# Altium project SCB.PrjPCB (part 1 of 2)
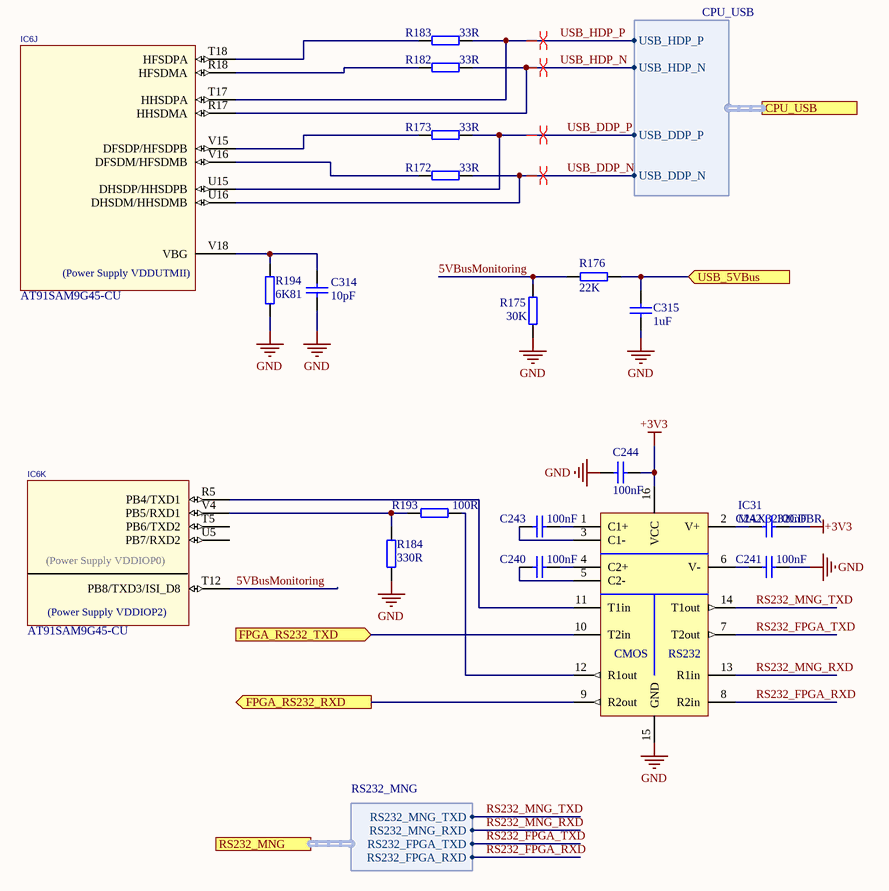
[diagram p0: RS232_and_USB_ports.SchDoc]
Date: 12/06/2012; Project: White Rabbit; Revision: 3.2
9 sheets, 226 parts. Net scope: hierarchical (ports join the sheet entries above them; power ports are global).
Board file: uTCA_MCH_PCB3.pcbdoc
Sheets:
  RS232_and_USB_ports.SchDoc
  CPU_EBI1_FPGA_Memory.SchDoc
  CPU_100M_Ethernet.SchDoc
  FPGA_GTX.SchDoc
  FPGA_Configuration.SchDoc
  uTCA_Tongue3.SchDoc
  SMI_Link_7-12.SchDoc
  QDRII_mem.SchDoc
    U_QDRII_power = QDRII_power.SchDoc

## Sheet RS232_and_USB_ports.SchDoc: RS232_and_USB_ports
size A4 portrait; Revision: 3.4; SheetNumber: 4; SheetTotal: 23; Date: 18/06/2014; DrawnBy: J. Gabriel R.E.; Organization: Seven Solutions S.L.; Address1: C/Baza, Parcela 19, Nave 3; Address2: Polнgono Ind. Juncaril; Address3: 18210-Peligros-Granada; Address4: Spain; WebAddress: www.sevensols.com; Project: White Rabbit; ProjectName: White Rabbit

### Parts
C240  100nF  [CC1005-0402]
C241  100nF  [CC1005-0402]
C242  100nF  [CC1005-0402]
C243  100nF  [CC1005-0402]
C244  100nF  [CC1005-0402]
C314  10pF  [CC1005-0402]
C315  1uF  [CC1005-0402]
IC6  AT91SAM9G45-CU  [TFBGA324]  (parts J,K of 12)
IC31  MAX3232CDBR  [SOP65P780X200-16N]
R172  33R  [0603]
R173  33R  [0603]
R175  30K  [0402]
R176  22K  [0402]
R182  33R  [0603]
R183  33R  [0603]
R184  330R  [0402]
R193  100R  [0402]
R194  6K81  [0402]

### Ports
CPU_USB (harness CPU_USB), FPGA_RS232_RXD (out), FPGA_RS232_TXD (in), RS232_MNG (harness RS232_MNG), USB_5VBus (in)

### Harnesses
RS232_MNG: RS232_MNG_TXD, RS232_FPGA_TXD, RS232_MNG_RXD, RS232_FPGA_RXD
CPU_USB: USB_HDP_P, USB_HDP_N, USB_DDP_P, USB_DDP_N

### Nets
+3V3: C242.1 C244.1 IC31.16(VCC)
GND: C241.1 C244.2 C314.1 C315.2 IC31.15(GND) R175.1 R184.2 R194.1
5VBusMonitoring: IC6.T12(PB8/TXD3/ISI_D8) R175.2 R176.2
RS232_FPGA_RXD: IC31.8(R2in) ; port RS232_MNG.RS232_FPGA_RXD
RS232_FPGA_TXD: IC31.7(T2out) ; port RS232_MNG.RS232_FPGA_TXD
RS232_MNG_RXD: IC31.13(R1in) ; port RS232_MNG.RS232_MNG_RXD
RS232_MNG_TXD: IC31.14(T1out) ; port RS232_MNG.RS232_MNG_TXD
USB_DDP_N: IC6.U16(DHSDM/HHSDMB) R172.2 ; port CPU_USB.USB_DDP_N
USB_DDP_P: IC6.U15(DHSDP/HHSDPB) R173.2 ; port CPU_USB.USB_DDP_P
USB_HDP_N: IC6.R17(HHSDMA) R182.2 ; port CPU_USB.USB_HDP_N
USB_HDP_P: IC6.T17(HHSDPA) R183.2 ; port CPU_USB.USB_HDP_P
NetC240_1: C240.1 IC31.4(C2+)
NetC240_2: C240.2 IC31.5(C2-)
NetC241_2: C241.2 IC31.6(V-)
NetC242_2: C242.2 IC31.2(V+)
NetC243_1: C243.1 IC31.1(C1+)
NetC243_2: C243.2 IC31.3(C1-)
NetC314_2: C314.2 IC6.V18(VBG) R194.2
NetC315_1: C315.1 R176.1 ; port USB_5VBus
NetIC6_R5: IC6.R5(PB4/TXD1) IC31.11(T1in)
NetIC6_R18: IC6.R18(HFSDMA) R182.1
NetIC6_T18: IC6.T18(HFSDPA) R183.1
NetIC6_V4: IC6.V4(PB5/RXD1) R184.1 R193.2
NetIC6_V15: IC6.V15(DFSDP/HFSDPB) R173.1
NetIC6_V16: IC6.V16(DFSDM/HFSDMB) R172.1
NetIC31_9: IC31.9(R2out) ; port FPGA_RS232_RXD
NetIC31_10: IC31.10(T2in) ; port FPGA_RS232_TXD
NetIC31_12: IC31.12(R1out) R193.1

Not connected (* = marked no-connect by the designer): IC6 T5(PB6/TXD2) U5(PB7/RXD2)

### Layout directives
differential pair: USB_DDP_N, USB_DDP_P, USB_HDP_N, USB_HDP_P

### Notes on the sheet
- Title:
- Size:
- Revision:
- A4
- Drawn by:
- Date:
- Sheet
- of
- Project:
- (in symbol AT91SAM9G45-CU, part J) (Power Supply VDDUTMII)
- (in symbol AT91SAM9G45-CU, part K) (Power Supply VDDIOP0); (Power Supply VDDIOP2)
- (in symbol IFC_MAX3232) CMOS; RS232

### Library data of the parts
C240-C244 = CC0402_100NF_16V_10%_X7R: Capacitor; Manufacturer1: TDK; Manufacturer1 PN: C1005X7R1C104K; TC: X7R; Tolerance: ±10%; Voltage: 16V; Published: 8-Jun-2000; LatestRevisionDate: 17-Jul-2002; LatestRevisionNote: Re-released for DXP Platform.; PackageReference: RAD-0.3; Publisher: Altium Limited; Distributor1: Digikey; Distributor1 PN: 445-4952-1-ND; Case: 0402; Value: 100nF
C314 = CC0402_10PF_50V_5%_NP0: Capacitor; Manufacturer1: TDK; Manufacturer1 PN: C1005C0G1H100D; TC: NPO; Tolerance: ±10%; Voltage: 50V; Published: 8-Jun-2000; LatestRevisionDate: 17-Jul-2002; LatestRevisionNote: Re-released for DXP Platform.; PackageReference: RAD-0.3; Publisher: Altium Limited; Distributor1: Digikey; Distributor1 PN: 445-1235-1-ND; Case: 0402; Value: 10pF
C315 = CC0402_1UF_16V_10%_X5R: Capacitor; Manufacturer1: TDK; Manufacturer1 PN: C1005X5R1C105K; TC: X5R; Tolerance: ±10%; Voltage: 16V; Published: 8-Jun-2000; LatestRevisionDate: 17-Jul-2002; LatestRevisionNote: Re-released for DXP Platform.; PackageReference: RAD-0.3; Publisher: Altium Limited; Distributor1: Digikey; Distributor1 PN: 445-4978-1-ND; Case: 0402; Value: 1uF
IC6 = AT91SAM9G45-CU: Atmel 400MHz ARM926 MCU; Value: AT91SAM9G45-CU; Distributor1 PN: AT91SAM9G45-CU-ND; Distributor1: Digikey
IC31 = IFC_MAX3232: Manufacturer1: Texas Instruments; Distributor1: Digikey; Distributor1 PN: 296-13093-1-ND; Manufacturer1 PN: MAX3232CDBR
R172 R173 R182 R183 = R0603_33R_±1%_0.25W_100PPM: SMD Resistor; Manufacturer1: Vishay/Dale; Manufacturer1 PN: CRCW060333R0FKEAHP; TCR: 100ppm; Power Rating: 0.25W; Tolerance: ±1%; Case: 0402; Distributor1: DigiKey; Distributor1 PN: 541-33.0SCT-ND; Value: 33R
R175 = R0402_30K_±1%_0.1W_100PPM: SMD Resistor; Manufacturer1: Panasonic; Manufacturer1 PN: ERJ-2RKF3002X; TCR: 100ppm; Power Rating: 0.1W; Tolerance: ±1%; Case: 0402; Distributor1: DigiKey; Distributor1 PN: P30.0KLCT-ND; Value: 30K
R176 = R0402_22K_±1%_0.1W_100PPM: SMD Resistor; Manufacturer1: Panasonic; Manufacturer1 PN: ERJ-2RKF2202X; TCR: 100ppm; Power Rating: 0.1W; Tolerance: ±1%; Case: 0402; Distributor1: DigiKey; Distributor1 PN: P22.0KLCT-ND; Value: 22K
R184 = R0402_330R_±1%_0.1W_100PPM: SMD Resistor; Manufacturer1: Panasonic; Manufacturer1 PN: ERJ-2RKF3300X; TCR: 100ppm; Power Rating: 0.1W; Tolerance: ±1%; Case: 0402; Distributor1: DigiKey; Distributor1 PN: P330LCT-ND; Value: 330R
R193 = R0402_100R_±1%_0.1W_100PPM: SMD Resistor; Manufacturer1: Panasonic; Manufacturer1 PN: ERJ-2RKF1000X; TCR: 100ppm; Power Rating: 0.1W; Tolerance: ±1%; Case: 0402; Distributor1: DigiKey; Distributor1 PN: P100LCT-ND; Value: 100R
R194 = R0402_6K81_±1%_0.1W_100PPM: SMD Resistor; Manufacturer1: Panasonic; Manufacturer1 PN: ERJ-2RKF6811X; TCR: 100ppm; Power Rating: 0.1W; Tolerance: ±1%; Case: 0402; Distributor1: DigiKey; Distributor1 PN: P6.81KLCT-ND; Value: 6K81

## Sheet CPU_EBI1_FPGA_Memory.SchDoc: CPU_EBI1_FPGA_Memory
size A3; Date: 18/06/2014; DrawnBy: J. Gabriel R.E.; Organization: Seven Solutions S.L.; Address1: C/Baza, Parcela 19, Nave 3; Address2: Polнgono Ind. Juncaril; Address3: 18210-Peligros-Granada; Address4: Spain; Revision: 3.4; SheetNumber: 5; SheetTotal: 23; WebAddress: www.sevensols.com; Project: White Rabbit; ProjectName: Project Name
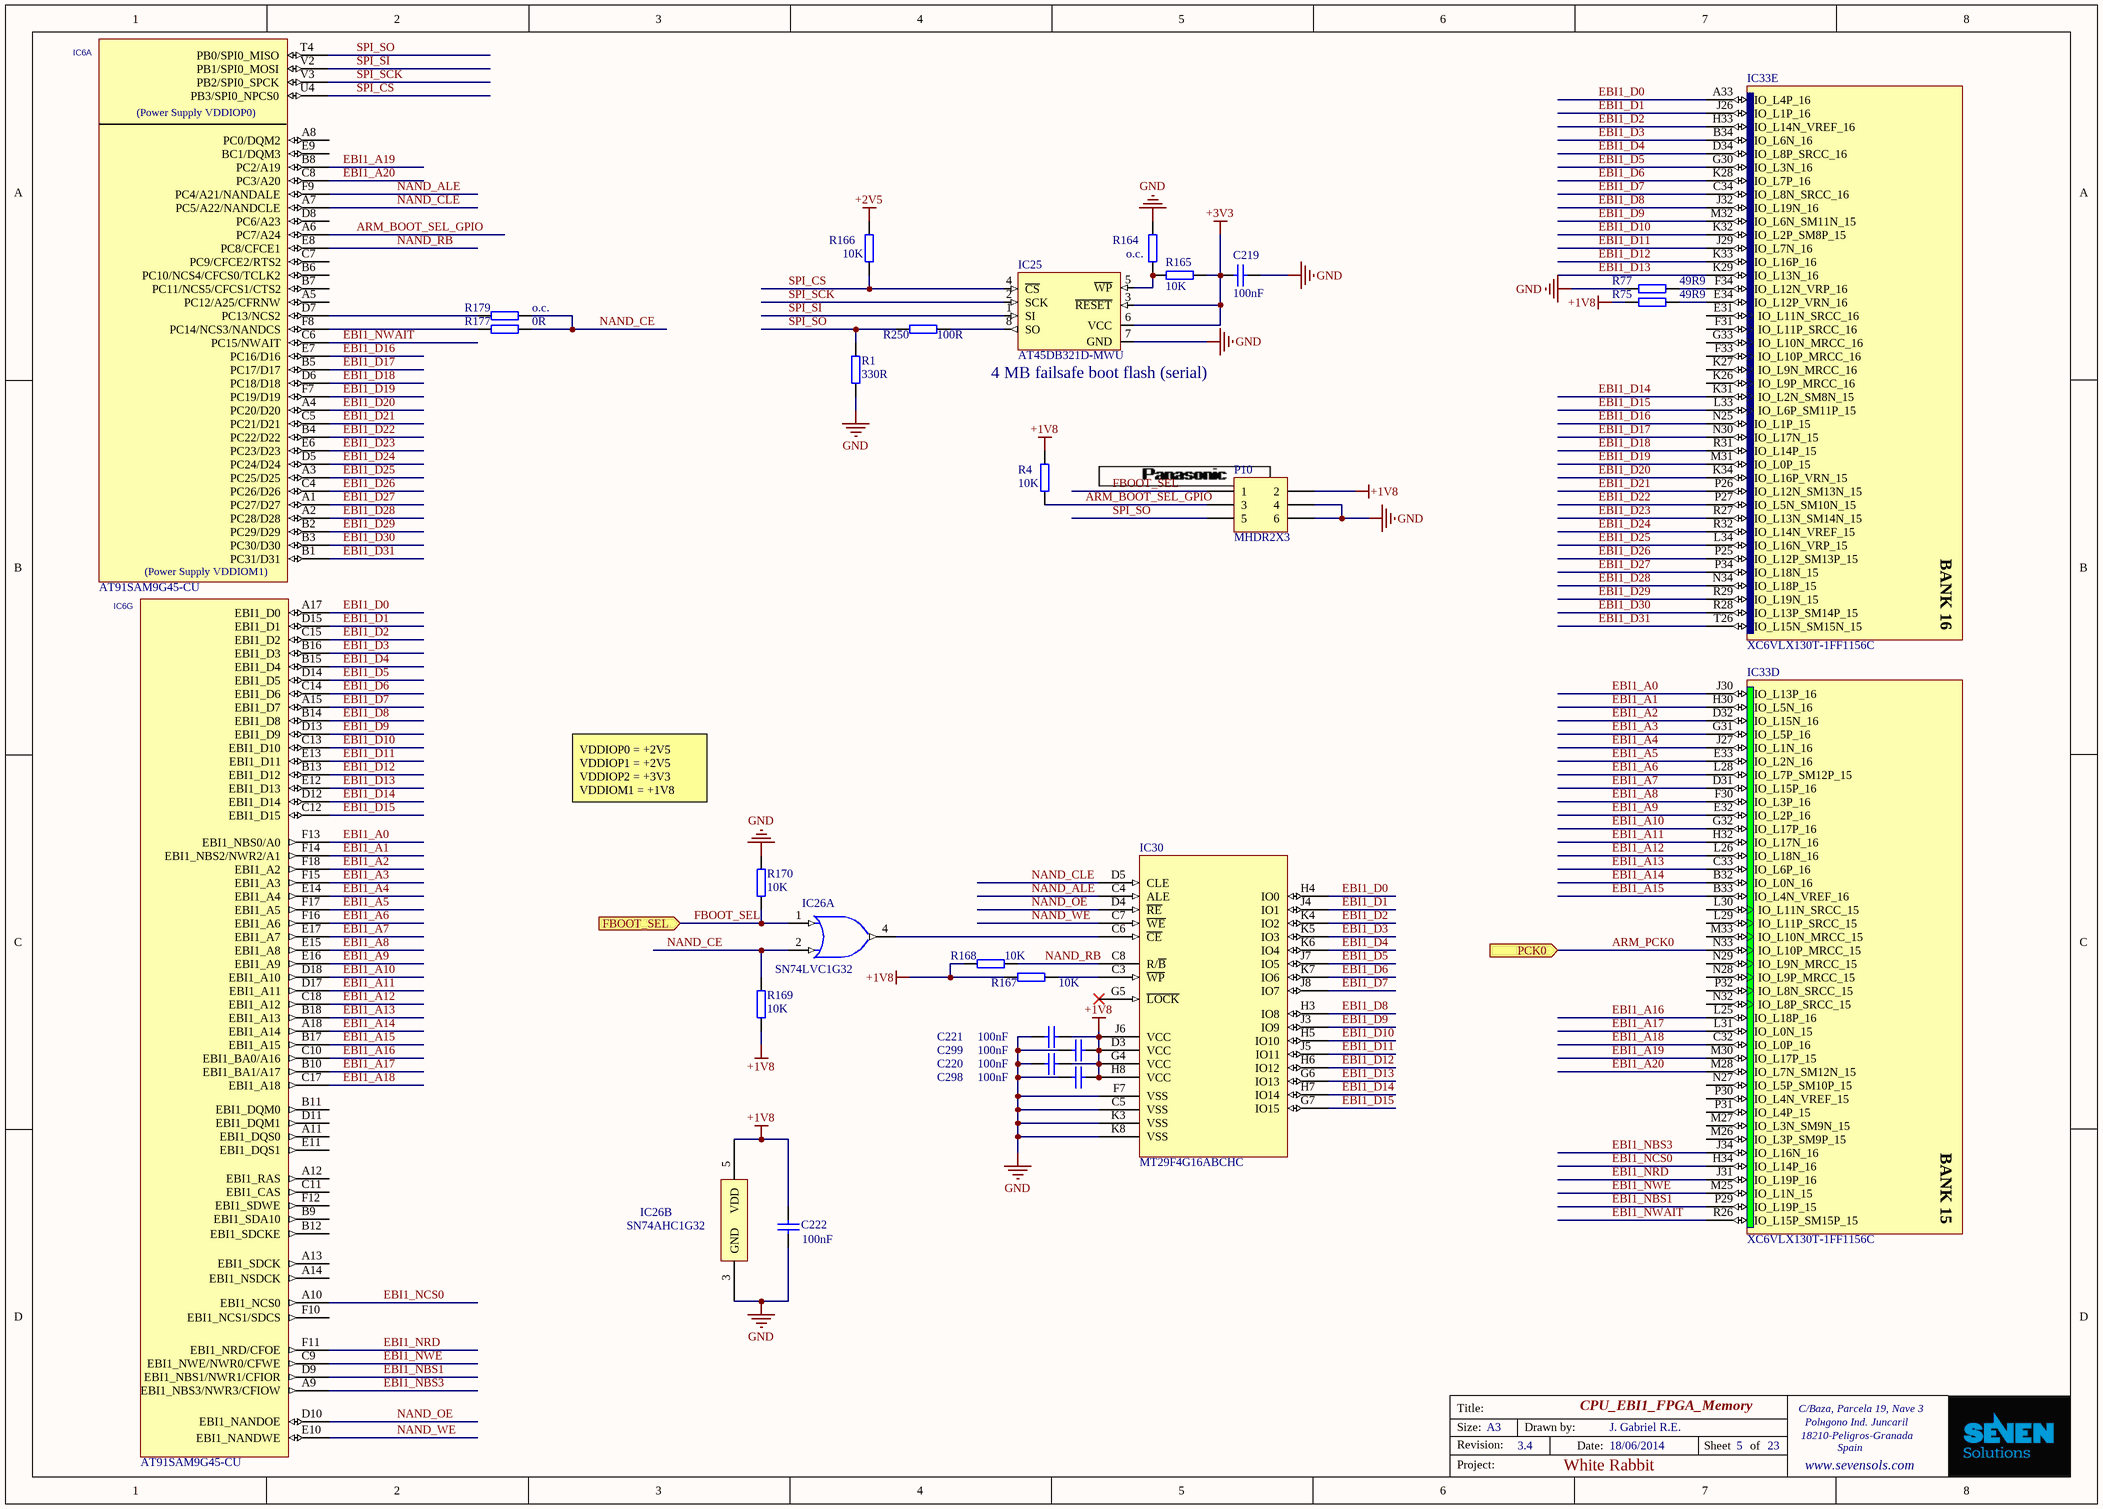
[diagram p1: CPU_EBI1_FPGA_Memory.SchDoc]

### Parts
C219  100nF  [CC1005-0402]
C220  100nF  [CC1005-0402]
C221  100nF  [CC1005-0402]
C222  100nF  [CC1005-0402]
C298  100nF  [CC1005-0402]
C299  100nF  [CC1005-0402]
IC6  AT91SAM9G45-CU  [TFBGA324]  (parts A,G of 12)
IC25  AT45DB321D-MWU  [8MW_8CN3_Merge]
IC26  SN74LVC1G32  [SOT23-5AL]  (parts A,B of 2)
IC30  MT29F4G16ABCHC  [VFBGA63]
IC33  XC6VLX130T-1FF1156C  [FF1156]  (parts D,E of 20)
P10  MHDR2X3  [MHDR2X3_1.27mm]
R1  330R  [0402]
R4  10K  [0402]
R75  49R9  [0402]
R77  49R9  [0402]
R164  o.c.  [0402]
R165  10K  [0402]
R166  10K  [0402]
R167  10K  [0402]
R168  10K  [0402]
R169  10K  [0402]
R170  10K  [0402]
R177  0R  [0603]
R179  o.c.  [0402]
R250  100R  [0402]

### Ports
FBOOT_SEL (in), PCK0 (in)

### Nets
+1V8: C220.1 C221.1 C222.2 C298.1 C299.1 IC26.5(VDD) IC30.D3(VCC) IC30.G4(VCC) IC30.H8(VCC) IC30.J6(VCC) P10.2 R4.2 R75.2 R167.2 R168.2 R169.2
+2V5: R166.2
+3V3: C219.1 IC25.3(~{RESET}) IC25.6(VCC) R165.2
GND: C219.2 C220.2 C221.2 C222.1 C298.2 C299.2 IC25.7(GND) IC26.3(GND) IC30.C5(VSS) IC30.F7(VSS) IC30.K3(VSS) IC30.K8(VSS) P10.4 P10.6 R1.1 R77.2 R164.1 R170.2
ARM_BOOT_SEL_GPIO: IC6.A6(PC7/A24) P10.3 R4.1
ARM_PCK0: IC33.N33(IO_L10P_MRCC_15) ; port PCK0
EBI1_A0: IC6.F13(EBI1_NBS0/A0) IC33.J30(IO_L13P_16)
EBI1_A1: IC6.F14(EBI1_NBS2/NWR2/A1) IC33.H30(IO_L5N_16)
EBI1_A2: IC6.F18(EBI1_A2) IC33.D32(IO_L15N_16)
EBI1_A3: IC6.F15(EBI1_A3) IC33.G31(IO_L5P_16)
EBI1_A4: IC6.E14(EBI1_A4) IC33.J27(IO_L1N_16)
EBI1_A5: IC6.F17(EBI1_A5) IC33.E33(IO_L2N_16)
EBI1_A6: IC6.F16(EBI1_A6) IC33.L28(IO_L7P_SM12P_15)
EBI1_A7: IC6.E17(EBI1_A7) IC33.D31(IO_L15P_16)
EBI1_A8: IC6.E15(EBI1_A8) IC33.F30(IO_L3P_16)
EBI1_A9: IC6.E16(EBI1_A9) IC33.E32(IO_L2P_16)
EBI1_A10: IC6.D18(EBI1_A10) IC33.G32(IO_L17P_16)
EBI1_A11: IC6.D17(EBI1_A11) IC33.H32(IO_L17N_16)
EBI1_A12: IC6.C18(EBI1_A12) IC33.L26(IO_L18N_16)
EBI1_A13: IC6.B18(EBI1_A13) IC33.C33(IO_L6P_16)
EBI1_A14: IC6.A18(EBI1_A14) IC33.B32(IO_L0N_16)
EBI1_A15: IC6.B17(EBI1_A15) IC33.B33(IO_L4N_VREF_16)
EBI1_A16: IC6.C10(EBI1_BA0/A16) IC33.L25(IO_L18P_16)
EBI1_A17: IC6.B10(EBI1_BA1/A17) IC33.L31(IO_L0N_15)
EBI1_A18: IC6.C17(EBI1_A18) IC33.C32(IO_L0P_16)
EBI1_A19: IC6.B8(PC2/A19) IC33.M30(IO_L17P_15)
EBI1_A20: IC6.C8(PC3/A20) IC33.M28(IO_L7N_SM12N_15)
EBI1_D0: IC6.A17(EBI1_D0) IC30.H4(IO0) IC33.A33(IO_L4P_16)
EBI1_D1: IC6.D15(EBI1_D1) IC30.J4(IO1) IC33.J26(IO_L1P_16)
EBI1_D2: IC6.C15(EBI1_D2) IC30.K4(IO2) IC33.H33(IO_L14N_VREF_16)
EBI1_D3: IC6.B16(EBI1_D3) IC30.K5(IO3) IC33.B34(IO_L6N_16)
EBI1_D4: IC6.B15(EBI1_D4) IC30.K6(IO4) IC33.D34(IO_L8P_SRCC_16)
EBI1_D5: IC6.D14(EBI1_D5) IC30.J7(IO5) IC33.G30(IO_L3N_16)
EBI1_D6: IC6.C14(EBI1_D6) IC30.K7(IO6) IC33.K28(IO_L7P_16)
EBI1_D7: IC6.A15(EBI1_D7) IC30.J8(IO7) IC33.C34(IO_L8N_SRCC_16)
EBI1_D8: IC6.B14(EBI1_D8) IC30.H3(IO8) IC33.J32(IO_L19N_16)
EBI1_D9: IC6.D13(EBI1_D9) IC30.J3(IO9) IC33.M32(IO_L6N_SM11N_15)
EBI1_D10: IC6.C13(EBI1_D10) IC30.H5(IO10) IC33.K32(IO_L2P_SM8P_15)
EBI1_D11: IC6.E13(EBI1_D11) IC30.J5(IO11) IC33.J29(IO_L7N_16)
EBI1_D12: IC6.B13(EBI1_D12) IC30.H6(IO12) IC33.K33(IO_L16P_16)
EBI1_D13: IC6.E12(EBI1_D13) IC30.G6(IO13) IC33.K29(IO_L13N_16)
EBI1_D14: IC6.D12(EBI1_D14) IC30.H7(IO14) IC33.K31(IO_L2N_SM8N_15)
EBI1_D15: IC6.C12(EBI1_D15) IC30.G7(IO15) IC33.L33(IO_L6P_SM11P_15)
EBI1_D16: IC6.E7(PC16/D16) IC33.N25(IO_L1P_15)
EBI1_D17: IC6.B5(PC17/D17) IC33.N30(IO_L17N_15)
EBI1_D18: IC6.D6(PC18/D18) IC33.R31(IO_L14P_15)
EBI1_D19: IC6.F7(PC19/D19) IC33.M31(IO_L0P_15)
EBI1_D20: IC6.A4(PC20/D20) IC33.K34(IO_L16P_VRN_15)
EBI1_D21: IC6.C5(PC21/D21) IC33.P26(IO_L12N_SM13N_15)
EBI1_D22: IC6.B4(PC22/D22) IC33.P27(IO_L5N_SM10N_15)
EBI1_D23: IC6.E6(PC23/D23) IC33.R27(IO_L13N_SM14N_15)
EBI1_D24: IC6.D5(PC24/D24) IC33.R32(IO_L14N_VREF_15)
EBI1_D25: IC6.A3(PC25/D25) IC33.L34(IO_L16N_VRP_15)
EBI1_D26: IC6.C4(PC26/D26) IC33.P25(IO_L12P_SM13P_15)
EBI1_D27: IC6.A1(PC27/D27) IC33.P34(IO_L18N_15)
EBI1_D28: IC6.A2(PC28/D28) IC33.N34(IO_L18P_15)
EBI1_D29: IC6.B2(PC29/D29) IC33.R29(IO_L19N_15)
EBI1_D30: IC6.B3(PC30/D30) IC33.R28(IO_L13P_SM14P_15)
EBI1_D31: IC6.B1(PC31/D31) IC33.T26(IO_L15N_SM15N_15)
EBI1_NBS1: IC6.D9(EBI1_NBS1/NWR1/CFIOR) IC33.P29(IO_L19P_15)
EBI1_NBS3: IC6.A9(EBI1_NBS3/NWR3/CFIOW) IC33.J34(IO_L16N_16)
EBI1_NCS0: IC6.A10(EBI1_NCS0) IC33.H34(IO_L14P_16)
EBI1_NRD: IC6.F11(EBI1_NRD/CFOE) IC33.J31(IO_L19P_16)
EBI1_NWAIT: IC6.C6(PC15/NWAIT) IC33.R26(IO_L15P_SM15P_15)
EBI1_NWE: IC6.C9(EBI1_NWE/NWR0/CFWE) IC33.M25(IO_L1N_15)
FBOOT_SEL: IC26.1(A) P10.1 R170.1 ; port FBOOT_SEL
NAND_ALE: IC6.F9(PC4/A21/NANDALE) IC30.C4(ALE)
NAND_CE: IC26.2(B) R169.1 R177.1 R179.1
NAND_CLE: IC6.A7(PC5/A22/NANDCLE) IC30.D5(CLE)
NAND_OE: IC6.D10(EBI1_NANDOE) IC30.D4(~{RE})
NAND_RB: IC6.E8(PC8/CFCE1) IC30.C8(R/~{B}) R168.1
NAND_WE: IC6.E10(EBI1_NANDWE) IC30.C7(~{WE})
SPI_CS: IC6.U4(PB3/SPI0_NPCS0) IC25.4(~{CS}) R166.1
SPI_SCK: IC6.V3(PB2/SPI0_SPCK) IC25.2(SCK)
SPI_SI: IC6.V2(PB1/SPI0_MOSI) IC25.1(SI)
SPI_SO: IC6.T4(PB0/SPI0_MISO) P10.5 R1.2 R250.2
NetIC6_D7: IC6.D7(PC13/NCS2) R179.2
NetIC6_F8: IC6.F8(PC14/NCS3/NANDCS) R177.2
NetIC25_5: IC25.5(~{WP}) R164.2 R165.1
NetIC25_8: IC25.8(SO) R250.1
NetIC26_4: IC26.4(Y) IC30.C6(~{CE})
NetIC30_C3: IC30.C3(~{WP}) R167.1
NetIC33_E34: IC33.E34(IO_L12P_VRN_16) R75.1
NetIC33_F34: IC33.F34(IO_L12N_VRP_16) R77.1

Not connected (* = marked no-connect by the designer): IC6 A5(PC12/A25/CFRNW) A8(PC0/DQM2) A11(EBI1_DQS0) A12(EBI1_RAS) A13(EBI1_SDCK) A14(EBI1_NSDCK) B6(PC10/NCS4/CFCS0/TCLK2) B7(PC11/NCS5/CFCS1/CTS2) B9(EBI1_SDA10) B11(EBI1_DQM0) B12(EBI1_SDCKE) C7(PC9/CFCE2/RTS2) C11(EBI1_CAS) D8(PC6/A23) D11(EBI1_DQM1) E9(BC1/DQM3) E11(EBI1_DQS1) F10(EBI1_NCS1/SDCS) F12(EBI1_SDWE); IC30 G5(~{LOCK})*; IC33 E31(IO_L11N_SRCC_16) F31(IO_L11P_SRCC_16) F33(IO_L10P_MRCC_16) G33(IO_L10N_MRCC_16) K26(IO_L9P_MRCC_16) K27(IO_L9N_MRCC_16) L29(IO_L11P_SRCC_15) L30(IO_L11N_SRCC_15) M26(IO_L3P_SM9P_15) M27(IO_L3N_SM9N_15) M33(IO_L10N_MRCC_15) N27(IO_L5P_SM10P_15) N28(IO_L9P_MRCC_15) N29(IO_L9N_MRCC_15) N32(IO_L8P_SRCC_15) P30(IO_L4N_VREF_15) P31(IO_L4P_15) P32(IO_L8N_SRCC_15)

### Notes on the sheet
- (near IC25) 4 MB failsafe boot flash (serial)
- VDDIOP0 = +2V5
  VDDIOP1 = +2V5
  VDDIOP2 = +3V3
  VDDIOM1 = +1V8
- Title:
- Size:
- Revision:
- A3
- Drawn by:
- Date:
- Sheet
- of
- Project:
- (in symbol AT91SAM9G45-CU, part A) (Power Supply VDDIOP0); (Power Supply VDDIOM1)
- (in symbol XC6VLX130T-1FF1156C, part D) BANK 15
- (in symbol XC6VLX130T-1FF1156C, part E) BANK 16

### Library data of the parts
C219-C222 C298 C299 = CC0402_100NF_16V_10%_X7R: as C240 on sheet RS232_and_USB_ports; Published: 8-Jun-2000; LatestRevisionDate: 17-Jul-2002; LatestRevisionNote: Re-released for DXP Platform.; PackageReference: RAD-0.3; Publisher: Altium Limited; Distributor1: Digikey; Distributor1 PN: 445-4952-1-ND; Case: 0402; Value: 100nF
IC6 = AT91SAM9G45-CU: Atmel 400MHz ARM926 MCU; Value: AT91SAM9G45-CU; Distributor1 PN: AT91SAM9G45-CU-ND; Distributor1: Digikey
IC25 = AT45DB642D: 64-megabit 2.7V, Dual-Interface DataFlash; Value: AT45DB321D-MWU; Distributor1 PN: 556-AT45DB321D-MWU; Case: VDFN; Distributor1: Mouser
IC26 = SN74AHC1G32: TI single OR gate; RefId: 296-9847-1-ND; Value: SN74LVC1G32DBVR; Supplier: Digikey
IC30 = MT29F4G16ABCHC: NAND Flash 256Mx16, 1.8V Asynch/Page; Value: MT29F4G16ABCHC:C TR; Distributor1: Digikey; Distributor1 PN: 557-1369-1-ND
IC33 = XC6VLX130T-1FF1156C: Virtex-6 LXT Platform FPGA, 600 User I/Os, 20 GTXs, 1156-Ball FFBGA, Speed Grade 1, Commercial Grade; FirstPublished: 17-Nov-2009; DatasheetVersion: v2.0, Sep-2009; PackageVersion: ver1.0, Jun-2009; PackageReference: FF1156; Publisher: Altium Limited; PackageDescription: 1156-Ball Flip-Chip Fine Pitch Ball Grid Array (FF1156); Code_JEDEC: MS-034-AAR-1; Code_IPC: BGA100P34X34-1156; ComponentLink1Description: Virtex-6 Datasheet; ComponentLink1URL: http://www.xilinx.com/support/documentation/data_sheets/ds150.pdf; ComponentLink2Description: Pinout Specification; ComponentLink2URL: http://www.xilinx.com/support/packagefiles/virtex-6-pkgs.htm; ComponentLink3Description: FF1156 Package Drawing; ComponentLink3URL: http://www.xilinx.com/support/documentation/package_specs/ff1156.pdf; ComponentLink4Description: Virtex-6 Documents; ComponentLink4URL: http://www.xilinx.com/support/documentation/virtex-6.htm; ComponentLink5Description: Xilinx.com Home; ComponentLink5URL: http://www.xilinx.com
P10 = MHDR2X3: SMD Header, 3-Pin, Dual row, 2.54mm pitch; Manufacturer1 PN: GRPB032VWVN-RC; Manufacturer1: Sullins; Distributor1: Digikey; Distributor1 PN: S9015E-03-ND
R1 = R0402_330R_±1%_0.1W_100PPM: as R184 on sheet RS232_and_USB_ports; Case: 0402; Distributor1: DigiKey; Distributor1 PN: P330LCT-ND; Value: 330R
R4 R165-R170 = R0402_10K_±1%_0.1W_100PPM: SMD Resistor; Manufacturer1: Panasonic; Manufacturer1 PN: ERJ-2RKF1002X; TCR: 100ppm; Power Rating: 0.1W; Tolerance: ±1%; Case: 0402; Distributor1: DigiKey; Distributor1 PN: P10.0KLCT-ND; Value: 10K
R75 R77 = R0402_49R9_±1%_0.1W_100PPM: SMD Resistor; Manufacturer1: Panasonic; Manufacturer1 PN: ERJ-2RKF49R9X; TCR: 100ppm; Power Rating: 0.1W; Tolerance: ±1%; Case: 0402; Distributor1: DigiKey; Distributor1 PN: P49.9LCT-ND; Value: 49R9
R164 R179 = R0402_O.C.: SMD Resistor; Mounted: No; Case: 0402; Manufacturer1: N/A; Manufacturer1 PN: N/A; Distributor1: N/A; Distributor1 PN: N/A; TCR: N/A; Power Rating: N/A; Tolerance: N/A; Value: o.c.
R177 = R0603_0R_0.1W_JUMPER: SMD Resistor; Manufacturer1: Yageo; Manufacturer1 PN: RC0603JR-070RL; TCR: 200ppm; Power Rating: 0.1W; Case: 0603; Distributor1: DigiKey; Distributor1 PN: 311-0.0GRCT-ND; Tolerance: -; Value: 0R
R250 = R0402_100R_±1%_0.1W_100PPM: as R193 on sheet RS232_and_USB_ports; Case: 0402; Distributor1: DigiKey; Distributor1 PN: P100LCT-ND; Value: 100R

## Sheet CPU_100M_Ethernet.SchDoc: CPU_100M_Ethernet
size A3; PageSetup: Record=PageOptions|CenterHorizontal=True|CenterVertical=True|PrintScale=1.42|XCorrection=1.00|YCorrection=1.00|PrintKind=1|BorderSize=5000000|LeftOffset=0|BottomOffset=0|Orientation=2|PaperLength=1000|PaperWidth=1000|Scale=100|PaperSource=7|PrintQuality=-4|MediaType=1|DitherType=10|PaperKind=A3|PrintScaleMode=1; Date: 18/06/2014; DrawnBy: J. Gabriel R.E.; Organization: Seven Solutions S.L.; Address1: C/Baza, Parcela 19, Nave 3; Address2: Polнgono Ind. Juncaril; Address3: 18210-Peligros-Granada; Address4: Spain; Revision: 3.4; SheetNumber: 6; SheetTotal: 23; WebAddress: www.sevensols.com; Project: White Rabbit; ProjectName: Project Name
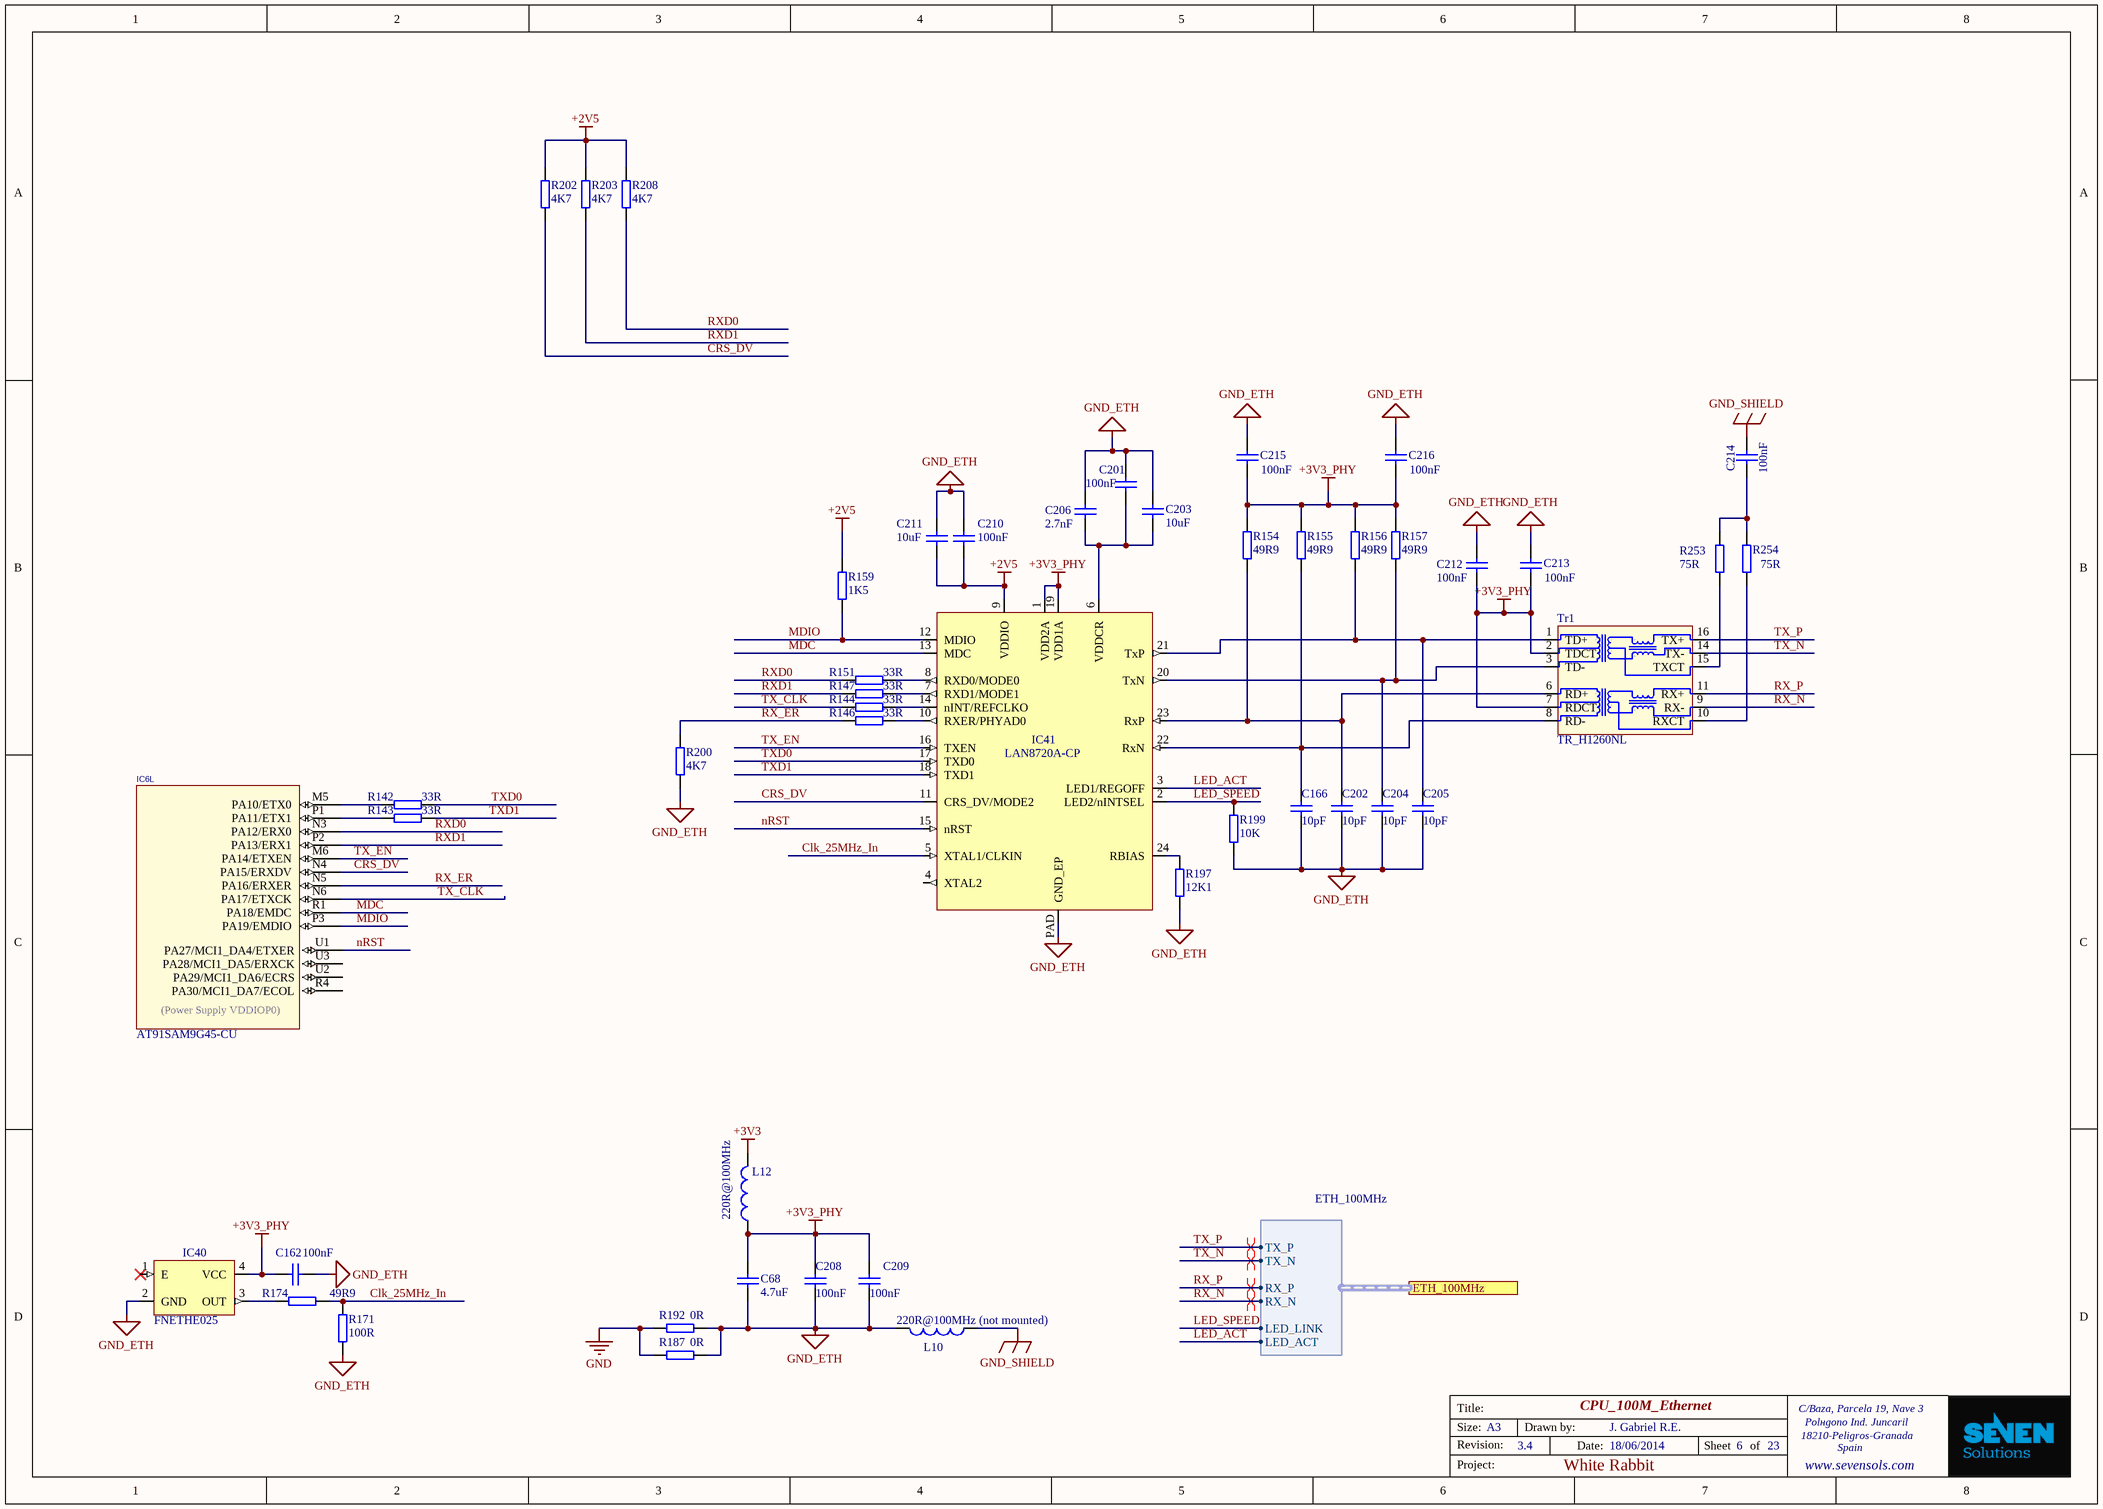
[diagram p2: CPU_100M_Ethernet.SchDoc]

### Parts
C68  4.7uF  [CC1608-0603]
C162  100nF  [CC1005-0402]
C166  10pF  [CC1005-0402]
C201  100nF  [CC1005-0402]
C202  10pF  [CC1005-0402]
C203  10uF  [CC1608-0603]
C204  10pF  [CC1005-0402]
C205  10pF  [CC1005-0402]
C206  2.7nF  [CC1005-0402]
C208  100nF  [CC1005-0402]
C209  100nF  [CC1005-0402]
C210  100nF  [CC1005-0402]
C211  10uF  [CC1608-0603]
C212  100nF  [CC1005-0402]
C213  100nF  [CC1005-0402]
C214  100nF  [CAPR500-250X720X650]
C215  100nF  [CC1005-0402]
C216  100nF  [CC1005-0402]
IC6  AT91SAM9G45-CU  [TFBGA324]  (part L of 12)
IC40  FNETHE025  [SPXO]
IC41  LAN8720A-CP  [QFN50P400X400-24W4M]
L10  Impedance: 220R@100MHz (not mounted)  [0603]  (hidden comment: 220R@100MHz Ferrite Bead)
L12  Impedance: 220R@100MHz  [0603]  (hidden comment: 220R@100MHz Ferrite Bead)
R142  33R  [0402]
R143  33R  [0402]
R144  33R  [0402]
R146  33R  [0402]
R147  33R  [0402]
R151  33R  [0402]
R154  49R9  [0603]
R155  49R9  [0603]
R156  49R9  [0603]
R157  49R9  [0603]
R159  1K5  [0402]
R171  100R  [0402]
R174  49R9  [0402]
R187  value 0R  [0402]  (hidden comment: Jumper)
R192  value 0R  [0402]  (hidden comment: Jumper)
R197  12K1  [0402]
R199  10k  [0402]
R200  4K7  [0402]
R202  4K7  [0402]
R203  4K7  [0402]
R208  4K7  [0402]
R253  75R  [0402]
R254  75R  [0402]
Tr1  TR_H1260NL  [H1260NL]

### Ports
ETH_100MHz (harness ETH_100MHz)

### Harnesses
ETH_100MHz: RX_P, TX_P, TX_N, RX_N, LED_LINK, LED_ACT

### Nets
+2V5: C210.2 C211.2 IC41.9(VDDIO) R159.2 R202.2 R203.2 R208.2
+3V3: L12.2
+3V3_PHY: C68.2 C162.2 C208.1 C209.1 C212.1 C213.1 C215.1 C216.1 IC40.4(VCC) IC41.1(VDD2A) IC41.19(VDD1A) L12.1 R154.2 R155.2 R156.2 R157.2 Tr1.2(TDCT) Tr1.7(RDCT)
GND: R187.2 R192.2
GND_ETH: C68.1 C162.1 C166.1 C201.1 C202.1 C203.1 C204.1 C205.1 C206.1 C208.2 C209.2 C210.1 C211.1 C212.2 C213.2 C215.2 C216.2 IC40.2(GND) IC41.PAD(GND_EP) L10.2 R171.1 R187.1 R192.1 R197.2 R199.1 R200.2
GND_SHIELD: C214.2 L10.1
Clk_25MHz_In: IC41.5(XTAL1/CLKIN) R171.2 R174.1
CRS_DV: IC6.N4(PA15/ERXDV) IC41.11(CRS_DV/MODE2) R202.1
LED_ACT: IC41.3(LED1/REGOFF) ; port ETH_100MHz.LED_ACT
LED_SPEED: IC41.2(LED2/nINTSEL) R199.2 ; port ETH_100MHz.LED_LINK
MDC: IC6.R1(PA18/EMDC) IC41.13(MDC)
MDIO: IC6.P3(PA19/EMDIO) IC41.12(MDIO) R159.1
nRST: IC6.U1(PA27/MCI1_DA4/ETXER) IC41.15(nRST)
RX_ER: IC6.N5(PA16/ERXER) R146.1 R200.1
RX_N: Tr1.9(RX-) ; port ETH_100MHz.RX_N
RX_P: Tr1.11(RX+) ; port ETH_100MHz.RX_P
RXD0: IC6.N3(PA12/ERX0) R151.1 R208.1
RXD1: IC6.P2(PA13/ERX1) R147.1 R203.1
TX_CLK: IC6.N6(PA17/ETXCK) R144.1
TX_EN: IC6.M6(PA14/ETXEN) IC41.16(TXEN)
TX_N: Tr1.14(TX-) ; port ETH_100MHz.TX_N
TX_P: Tr1.16(TX+) ; port ETH_100MHz.TX_P
TXD0: IC41.17(TXD0) R142.2
TXD1: IC41.18(TXD1) R143.2
NetC166_2: C166.2 IC41.22(RxN) R155.1 Tr1.8(RD-)
NetC201_2: C201.2 C203.2 C206.2 IC41.6(VDDCR)
NetC202_2: C202.2 IC41.23(RxP) R154.1 Tr1.6(RD+)
NetC204_2: C204.2 IC41.20(TxN) R157.1 Tr1.3(TD-)
NetC205_2: C205.2 IC41.21(TxP) R156.1 Tr1.1(TD+)
NetC214_1: C214.1 R253.2 R254.2
NetIC6_M5: IC6.M5(PA10/ETX0) R142.1
NetIC6_P1: IC6.P1(PA11/ETX1) R143.1
NetIC40_3: IC40.3(OUT) R174.2
NetIC41_7: IC41.7(RXD1/MODE1) R147.2
NetIC41_8: IC41.8(RXD0/MODE0) R151.2
NetIC41_10: IC41.10(RXER/PHYAD0) R146.2
NetIC41_14: IC41.14(nINT/REFCLKO) R144.2
NetIC41_24: IC41.24(RBIAS) R197.1
NetR253_1: R253.1 Tr1.15(TXCT)
NetR254_1: R254.1 Tr1.10(RXCT)

Not connected (* = marked no-connect by the designer): IC6 R4(PA30/MCI1_DA7/ECOL) U2(PA29/MCI1_DA6/ECRS) U3(PA28/MCI1_DA5/ERXCK); IC40 1(E)*; IC41 4(XTAL2)

### Layout directives
differential pair: RX_N, RX_P, TX_N, TX_P

### Notes on the sheet
- Title:
- Size:
- Revision:
- A3
- Drawn by:
- Date:
- Sheet
- of
- Project:
- (in symbol AT91SAM9G45-CU, part L) (Power Supply VDDIOP0)

### Library data of the parts
C68 = CC0603_4.7UF_10V_10%_X5R: Capacitor; Manufacturer1: TDK; Manufacturer1 PN: C1608X5R1A475K; TC: X5R; Tolerance: ±10%; Voltage: 10V; Published: 8-Jun-2000; LatestRevisionDate: 17-Jul-2002; LatestRevisionNote: Re-released for DXP Platform.; PackageReference: RAD-0.3; Publisher: Altium Limited; Distributor1: Digikey; Distributor1 PN: 445-5170-1-ND; Case: 0603; Value: 4.7uF
C162 C201 C208-C210 C212 C213 C215 C216 = CC0402_100NF_16V_10%_X7R: as C240 on sheet RS232_and_USB_ports; Published: 8-Jun-2000; LatestRevisionDate: 17-Jul-2002; LatestRevisionNote: Re-released for DXP Platform.; PackageReference: RAD-0.3; Publisher: Altium Limited; Distributor1: Digikey; Distributor1 PN: 445-4952-1-ND; Case: 0402; Value: 100nF
C166 C202 C204 C205 = CC0402_10PF_50V_5%_NP0: as C314 on sheet RS232_and_USB_ports; Published: 8-Jun-2000; LatestRevisionDate: 17-Jul-2002; LatestRevisionNote: Re-released for DXP Platform.; PackageReference: RAD-0.3; Publisher: Altium Limited; Distributor1: Digikey; Distributor1 PN: 445-1235-1-ND; Case: 0402; Value: 10pF
C203 C211 = CC0603_10UF_6.3V_20%_X5R: Capacitor; Manufacturer1: TDK; Manufacturer1 PN: C1608X5R0J106M; TC: X5R; Tolerance: ±20%; Voltage: 6.3V; Published: 8-Jun-2000; LatestRevisionDate: 17-Jul-2002; LatestRevisionNote: Re-released for DXP Platform.; PackageReference: RAD-0.3; Publisher: Altium Limited; Distributor1: Digikey; Distributor1 PN: 445-4112-1-ND; Case: 0603; Value: 10uF
C206 = CC0402_2.7NF_50V_10%_X7R: Capacitor; Manufacturer1: Panasonic; Manufacturer1 PN: ECJ-0EB1H272K; TC: X7R; Tolerance: ±10%; Voltage: 50V; Published: 8-Jun-2000; LatestRevisionDate: 17-Jul-2002; LatestRevisionNote: Re-released for DXP Platform.; PackageReference: RAD-0.3; Publisher: Altium Limited; Distributor1: Digikey; Distributor1 PN: PCC1726CT-ND; Case: 0402; Value: 2.7nF
C214 = CPER_100NF_100V_10%_500-250X720X650: Non-polarised capacitor; Part Description: Metallized Polyester Film Capacitor (MKT); Manufacturer: EPCOS; Manufacturer Part Number: B32529C1104K000; Voltage: 100VDC/63VAC; Tolerance: ±10%; Table: Capacitors THD; Part Number: CPER_100NF_100V_10%_500-250X720X650; Component Kind: Standard; Component Type: Standard; Pin Count: 2; Value: 100nF; Status: None; Case: LS5 W2.5 x L7.2 x H6.5; Mounted: Yes; Socket: No; SMD: No; ComponentHeight: 6.5mm; HelpURL: \\cern.ch\dfs\Applications\Altium\Datasheets\CPER_EPCOS_B32529.pdf; Author: CERN DEM JLC; CreateDate: 3/22/2010; LatestRevisionDate: 3/22/2010
IC6 = AT91SAM9G45-CU: Atmel 400MHz ARM926 MCU; Value: AT91SAM9G45-CU; Distributor1 PN: AT91SAM9G45-CU-ND; Distributor1: Digikey
IC40 = OSC_CFPS-73: SMD oscillator 3.3V (Elfa); Value: FNETHE025; Distributor: Digikey; Distributor PN: FNETHE025CT-ND
IC41 = LAN8720A-CP: RMII ethernet transceiver with auto MIDIX; Manufacturer: SMSC; Value: LAN8720A-CP; Distributor1: Digikey; Distributor1 PN: 638-1080-ND
L10 = L_FERRITE_BEAD: ferrite bead; Manufacturer1: Murata; Manufacturer1 PN: BLM18KG221SN1D; Current Rating: 2.2A; DCR: 50mOhm; Mounted: No; Case: 0603; Distributor1: Digikey; Distributor1 PN: 490-5255-1-ND
L12 = L_FERRITE_BEAD: ferrite bead; Manufacturer1: Murata; Manufacturer1 PN: BLM18KG221SN1D; Current Rating: 2.2A; DCR: 50mOhm; Case: 0603; Distributor1: Digikey; Distributor1 PN: 490-5255-1-ND
R142-R144 R146 R147 R151 = R0402_33R_±1%_0.1W_100PPM: SMD Resistor; Manufacturer1: Panasonic; Manufacturer1 PN: ERJ-2RKF33R0X; TCR: 100ppm; Power Rating: 0.1W; Tolerance: ±1%; Case: 0402; Distributor1: DigiKey; Distributor1 PN: P33.0LCT-ND; Value: 33R
R154-R157 = R0603_49R9_±1%_0.25W_100PPM: SMD Resistor; Manufacturer1: Vishay/Dale; Manufacturer1 PN: CRCW060349R9FKEAHP; TCR: 100ppm; Power Rating: 0.25W; Tolerance: ±1%; Case: 0603; Distributor1: DigiKey; Distributor1 PN: 541-49.9SCT-ND; Value: 49R9
R159 = R0402_1K5_±1%_0.1W_100PPM: SMD Resistor; Manufacturer1: Panasonic; Manufacturer1 PN: ERJ-2RKF1501X; TCR: 100ppm; Power Rating: 0.1W; Tolerance: ±1%; Case: 0402; Distributor1: DigiKey; Distributor1 PN: P1.50KLCT-ND; Value: 1K5
R171 = R0402_100R_±1%_0.1W_100PPM: as R193 on sheet RS232_and_USB_ports; Case: 0402; Distributor1: DigiKey; Distributor1 PN: P100LCT-ND; Value: 100R
R174 = R0402_49R9_±1%_0.1W_100PPM: as R75 on sheet CPU_EBI1_FPGA_Memory; Case: 0402; Distributor1: DigiKey; Distributor1 PN: P49.9LCT-ND; Value: 49R9
R187 R192 = R0402_0R_0.1W_JUMPER: SMD Resistor; Manufacturer1: Panasonic; Manufacturer1 PN: ERJ-2GE0R00X; TCR: 100ppm; Power Rating: 0.1W; Case: 0402; Distributor1: DigiKey; Distributor1 PN: P0.0JCT-ND; Tolerance: Jumper
R197 = R0402_12K1_±1%_0.1W_100PPM: SMD Resistor; Manufacturer1: Panasonic; Manufacturer1 PN: ERJ-2RKF1212X; TCR: 100ppm; Power Rating: 0.1W; Tolerance: ±1%; Case: 0402; Distributor1: DigiKey; Distributor1 PN: P12.1KLCT-ND; Value: 12K1
R199 = R0402_10K_±1%_0.1W_100PPM: as R4 on sheet CPU_EBI1_FPGA_Memory; Case: 0402; Distributor1: DigiKey; Distributor1 PN: P10.0KLCT-ND; Value: 10K
R200 R202 R203 R208 = R0402_4.7K_±1%_0.1W_100PPM: SMD Resistor; Manufacturer1: Panasonic; Manufacturer1 PN: ERJ-2RKF4701X; TCR: 100ppm; Power Rating: 0.1W; Tolerance: ±1%; Case: 0402; Distributor1: DigiKey; Distributor1 PN: ERJ-2RKF4701X; Value: 4K7
R253 R254 = R0402_75R_±1%_0.1W_100PPM: SMD Resistor; Manufacturer1: Panasonic; Manufacturer1 PN: ERJ-2RKF75R0X; TCR: 100ppm; Power Rating: 0.1W; Tolerance: ±1%; Case: 0402; Distributor1: DigiKey; Distributor1 PN: P75.0LCT-ND; Value: 75R
Tr1 = TR_H1260NL: ethernet trafo (TME); Value: H1260NL; Distributor1 PN: 553-1328-ND; Distributor1: Digikey

## Sheet FPGA_GTX.SchDoc: FPGA_GTX
size A3; Date: 18/06/2014; DrawnBy: J. Gabriel R.E.; Organization: Seven Solutions S.L.; Address1: C/Baza, Parcela 19, Nave 3; Address2: Polнgono Ind. Juncaril; Address3: 18210-Peligros-Granada; Address4: Spain; Revision: 3.4; SheetNumber: 7; SheetTotal: 23; WebAddress: www.sevensols.com; Project: White Rabbit; ProjectName: Project Name
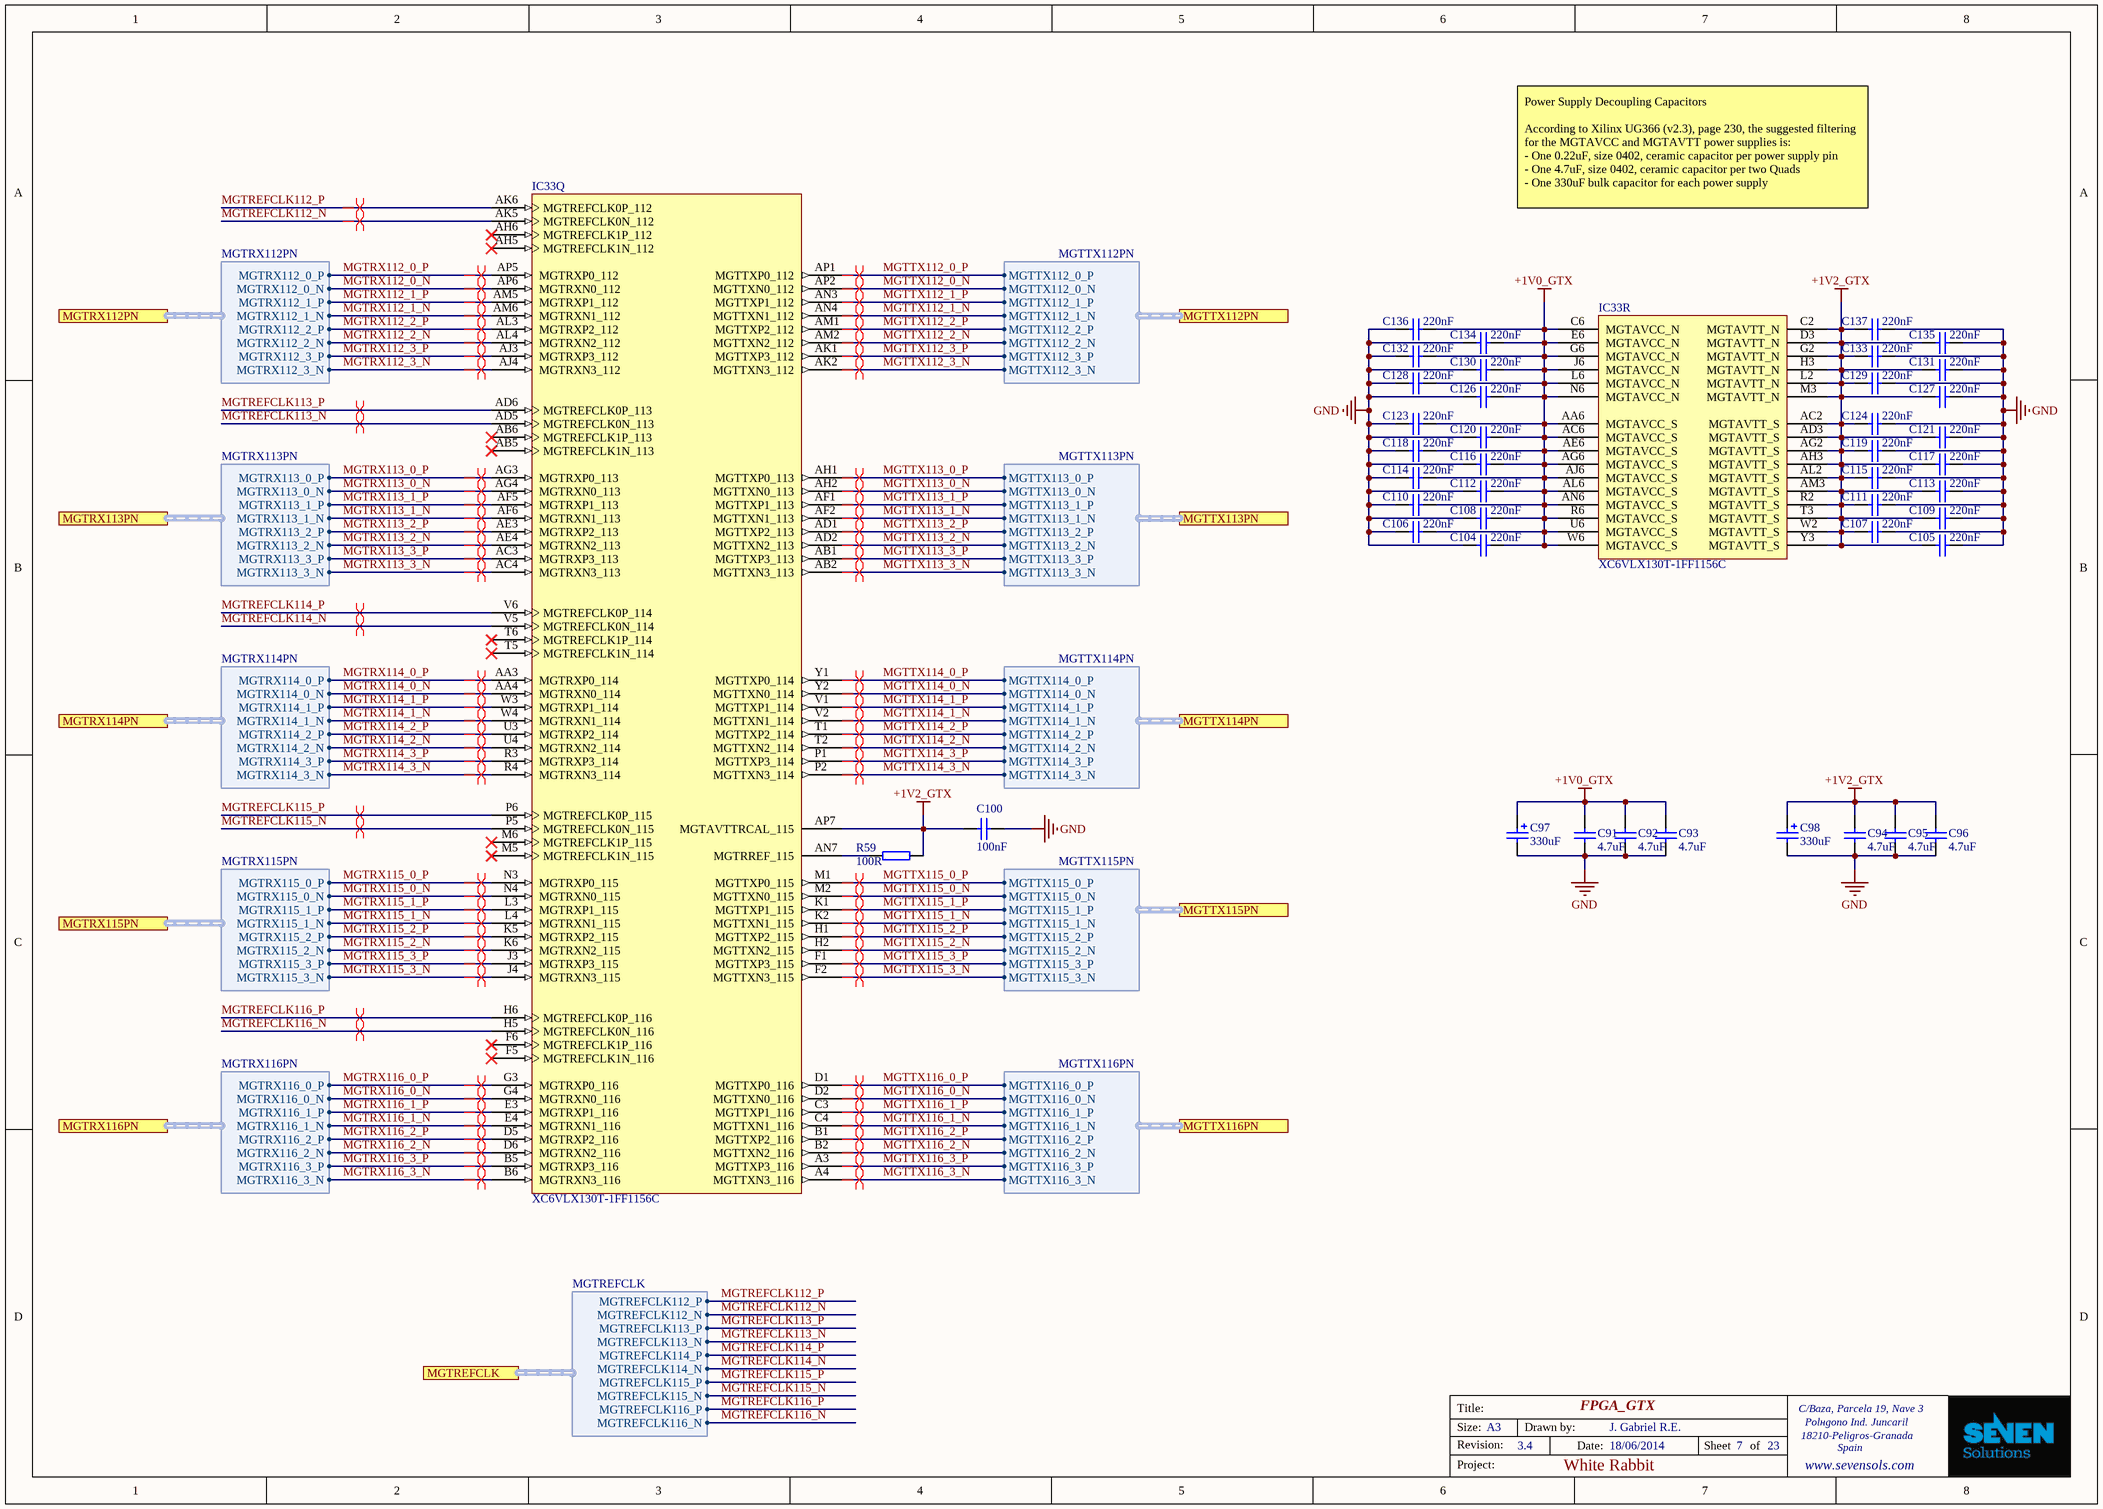
[diagram p3: FPGA_GTX.SchDoc]

### Parts
C91  4.7uF  [CC1608-0603]
C92  4.7uF  [CC1608-0603]
C93  4.7uF  [CC1608-0603]
C94  4.7uF  [CC1608-0603]
C95  4.7uF  [CC1608-0603]
C96  4.7uF  [CC1608-0603]
C97  330uF  [D]
C98  330uF  [D]
C100  100nF  [CC1005-0402]
C104  220nF  [CC1005-0402]
C105  220nF  [CC1005-0402]
C106  220nF  [CC1005-0402]
C107  220nF  [CC1005-0402]
C108  220nF  [CC1005-0402]
C109  220nF  [CC1005-0402]
C110  220nF  [CC1005-0402]
C111  220nF  [CC1005-0402]
C112  220nF  [CC1005-0402]
C113  220nF  [CC1005-0402]
C114  220nF  [CC1005-0402]
C115  220nF  [CC1005-0402]
C116  220nF  [CC1005-0402]
C117  220nF  [CC1005-0402]
C118  220nF  [CC1005-0402]
C119  220nF  [CC1005-0402]
C120  220nF  [CC1005-0402]
C121  220nF  [CC1005-0402]
C123  220nF  [CC1005-0402]
C124  220nF  [CC1005-0402]
C126  220nF  [CC1005-0402]
C127  220nF  [CC1005-0402]
C128  220nF  [CC1005-0402]
C129  220nF  [CC1005-0402]
C130  220nF  [CC1005-0402]
C131  220nF  [CC1005-0402]
C132  220nF  [CC1005-0402]
C133  220nF  [CC1005-0402]
C134  220nF  [CC1005-0402]
C135  220nF  [CC1005-0402]
C136  220nF  [CC1005-0402]
C137  220nF  [CC1005-0402]
IC33  XC6VLX130T-1FF1156C  [FF1156]  (parts Q,R of 20)
R59  100R  [0402]

### Ports
MGTREFCLK (harness MGTREFCLK), MGTRX112PN (harness MGTRX112PN), MGTRX113PN (harness MGTRX113PN), MGTRX114PN (harness MGTRX114PN), MGTRX115PN (harness MGTRX115PN), MGTRX116PN (harness MGTRX116PN), MGTTX112PN (harness MGTTX112PN), MGTTX113PN (harness MGTTX113PN), MGTTX114PN (harness MGTTX114PN), MGTTX115PN (harness MGTTX115PN), MGTTX116PN (harness MGTTX116PN)

### Harnesses
MGTREFCLK: MGTREFCLK112_P, MGTREFCLK112_N, MGTREFCLK113_P, MGTREFCLK113_N, MGTREFCLK114_P, MGTREFCLK114_N, MGTREFCLK115_P, MGTREFCLK115_N, MGTREFCLK116_P, MGTREFCLK116_N
MGTRX116PN: MGTRX116_0_P, MGTRX116_0_N, MGTRX116_1_P, MGTRX116_1_N, MGTRX116_2_P, MGTRX116_2_N, MGTRX116_3_P, MGTRX116_3_N
MGTRX115PN: MGTRX115_0_P, MGTRX115_0_N, MGTRX115_1_P, MGTRX115_1_N, MGTRX115_2_P, MGTRX115_2_N, MGTRX115_3_P, MGTRX115_3_N
MGTRX114PN: MGTRX114_0_P, MGTRX114_0_N, MGTRX114_1_P, MGTRX114_1_N, MGTRX114_2_P, MGTRX114_2_N, MGTRX114_3_P, MGTRX114_3_N
MGTRX113PN: MGTRX113_0_P, MGTRX113_0_N, MGTRX113_1_P, MGTRX113_1_N, MGTRX113_2_P, MGTRX113_2_N, MGTRX113_3_P, MGTRX113_3_N
MGTRX112PN: MGTRX112_0_P, MGTRX112_0_N, MGTRX112_1_P, MGTRX112_1_N, MGTRX112_2_P, MGTRX112_2_N, MGTRX112_3_P, MGTRX112_3_N
MGTTX112PN: MGTTX112_0_P, MGTTX112_0_N, MGTTX112_1_P, MGTTX112_1_N, MGTTX112_2_P, MGTTX112_2_N, MGTTX112_3_P, MGTTX112_3_N
MGTTX113PN: MGTTX113_0_P, MGTTX113_0_N, MGTTX113_1_P, MGTTX113_1_N, MGTTX113_2_P, MGTTX113_2_N, MGTTX113_3_P, MGTTX113_3_N
MGTTX114PN: MGTTX114_0_P, MGTTX114_0_N, MGTTX114_1_P, MGTTX114_1_N, MGTTX114_2_P, MGTTX114_2_N, MGTTX114_3_P, MGTTX114_3_N
MGTTX115PN: MGTTX115_0_P, MGTTX115_0_N, MGTTX115_1_P, MGTTX115_1_N, MGTTX115_2_P, MGTTX115_2_N, MGTTX115_3_P, MGTTX115_3_N
MGTTX116PN: MGTTX116_0_P, MGTTX116_0_N, MGTTX116_1_P, MGTTX116_1_N, MGTTX116_2_P, MGTTX116_2_N, MGTTX116_3_P, MGTTX116_3_N

### Nets
+1V0_GTX: C91.2 C92.2 C93.2 C97.1 C104.2 C106.2 C108.2 C110.2 C112.2 C114.2 C116.2 C118.2 C120.2 C123.2 C126.2 C128.2 C130.2 C132.2 C134.2 C136.2 IC33.AA6(MGTAVCC_S) IC33.AC6(MGTAVCC_S) IC33.AE6(MGTAVCC_S) IC33.AG6(MGTAVCC_S) IC33.AJ6(MGTAVCC_S) IC33.AL6(MGTAVCC_S) IC33.AN6(MGTAVCC_S) IC33.C6(MGTAVCC_N) IC33.E6(MGTAVCC_N) IC33.G6(MGTAVCC_N) IC33.J6(MGTAVCC_N) IC33.L6(MGTAVCC_N) IC33.N6(MGTAVCC_N) IC33.R6(MGTAVCC_S) IC33.U6(MGTAVCC_S) IC33.W6(MGTAVCC_S)
+1V2_GTX: C94.2 C95.2 C96.2 C98.1 C100.2 C105.1 C107.1 C109.1 C111.1 C113.1 C115.1 C117.1 C119.1 C121.1 C124.1 C127.1 C129.1 C131.1 C133.1 C135.1 C137.1 IC33.AC2(MGTAVTT_S) IC33.AD3(MGTAVTT_S) IC33.AG2(MGTAVTT_S) IC33.AH3(MGTAVTT_S) IC33.AL2(MGTAVTT_S) IC33.AM3(MGTAVTT_S) IC33.AP7(MGTAVTTRCAL_115) IC33.C2(MGTAVTT_N) IC33.D3(MGTAVTT_N) IC33.G2(MGTAVTT_N) IC33.H3(MGTAVTT_N) IC33.L2(MGTAVTT_N) IC33.M3(MGTAVTT_N) IC33.R2(MGTAVTT_S) IC33.T3(MGTAVTT_S) IC33.W2(MGTAVTT_S) IC33.Y3(MGTAVTT_S) R59.1
GND: C91.1 C92.1 C93.1 C94.1 C95.1 C96.1 C97.2 C98.2 C100.1 C104.1 C105.2 C106.1 C107.2 C108.1 C109.2 C110.1 C111.2 C112.1 C113.2 C114.1 C115.2 C116.1 C117.2 C118.1 C119.2 C120.1 C121.2 C123.1 C124.2 C126.1 C127.2 C128.1 C129.2 C130.1 C131.2 C132.1 C133.2 C134.1 C135.2 C136.1 C137.2
MGTREFCLK112_N: IC33.AK5(MGTREFCLK0N_112) ; port MGTREFCLK.MGTREFCLK112_N
MGTREFCLK112_P: IC33.AK6(MGTREFCLK0P_112) ; port MGTREFCLK.MGTREFCLK112_P
MGTREFCLK113_N: IC33.AD5(MGTREFCLK0N_113) ; port MGTREFCLK.MGTREFCLK113_N
MGTREFCLK113_P: IC33.AD6(MGTREFCLK0P_113) ; port MGTREFCLK.MGTREFCLK113_P
MGTREFCLK114_N: IC33.V5(MGTREFCLK0N_114) ; port MGTREFCLK.MGTREFCLK114_N
MGTREFCLK114_P: IC33.V6(MGTREFCLK0P_114) ; port MGTREFCLK.MGTREFCLK114_P
MGTREFCLK115_N: IC33.P5(MGTREFCLK0N_115) ; port MGTREFCLK.MGTREFCLK115_N
MGTREFCLK115_P: IC33.P6(MGTREFCLK0P_115) ; port MGTREFCLK.MGTREFCLK115_P
MGTREFCLK116_N: IC33.H5(MGTREFCLK0N_116) ; port MGTREFCLK.MGTREFCLK116_N
MGTREFCLK116_P: IC33.H6(MGTREFCLK0P_116) ; port MGTREFCLK.MGTREFCLK116_P
MGTRX112_0_N: IC33.AP6(MGTRXN0_112) ; port MGTRX112PN.MGTRX112_0_N
MGTRX112_0_P: IC33.AP5(MGTRXP0_112) ; port MGTRX112PN.MGTRX112_0_P
MGTRX112_1_N: IC33.AM6(MGTRXN1_112) ; port MGTRX112PN.MGTRX112_1_N
MGTRX112_1_P: IC33.AM5(MGTRXP1_112) ; port MGTRX112PN.MGTRX112_1_P
MGTRX112_2_N: IC33.AL4(MGTRXN2_112) ; port MGTRX112PN.MGTRX112_2_N
MGTRX112_2_P: IC33.AL3(MGTRXP2_112) ; port MGTRX112PN.MGTRX112_2_P
MGTRX112_3_N: IC33.AJ4(MGTRXN3_112) ; port MGTRX112PN.MGTRX112_3_N
MGTRX112_3_P: IC33.AJ3(MGTRXP3_112) ; port MGTRX112PN.MGTRX112_3_P
MGTRX113_0_N: IC33.AG4(MGTRXN0_113) ; port MGTRX113PN.MGTRX113_0_N
MGTRX113_0_P: IC33.AG3(MGTRXP0_113) ; port MGTRX113PN.MGTRX113_0_P
MGTRX113_1_N: IC33.AF6(MGTRXN1_113) ; port MGTRX113PN.MGTRX113_1_N
MGTRX113_1_P: IC33.AF5(MGTRXP1_113) ; port MGTRX113PN.MGTRX113_1_P
MGTRX113_2_N: IC33.AE4(MGTRXN2_113) ; port MGTRX113PN.MGTRX113_2_N
MGTRX113_2_P: IC33.AE3(MGTRXP2_113) ; port MGTRX113PN.MGTRX113_2_P
MGTRX113_3_N: IC33.AC4(MGTRXN3_113) ; port MGTRX113PN.MGTRX113_3_N
MGTRX113_3_P: IC33.AC3(MGTRXP3_113) ; port MGTRX113PN.MGTRX113_3_P
MGTRX114_0_N: IC33.AA4(MGTRXN0_114) ; port MGTRX114PN.MGTRX114_0_N
MGTRX114_0_P: IC33.AA3(MGTRXP0_114) ; port MGTRX114PN.MGTRX114_0_P
MGTRX114_1_N: IC33.W4(MGTRXN1_114) ; port MGTRX114PN.MGTRX114_1_N
MGTRX114_1_P: IC33.W3(MGTRXP1_114) ; port MGTRX114PN.MGTRX114_1_P
MGTRX114_2_N: IC33.U4(MGTRXN2_114) ; port MGTRX114PN.MGTRX114_2_N
MGTRX114_2_P: IC33.U3(MGTRXP2_114) ; port MGTRX114PN.MGTRX114_2_P
MGTRX114_3_N: IC33.R4(MGTRXN3_114) ; port MGTRX114PN.MGTRX114_3_N
MGTRX114_3_P: IC33.R3(MGTRXP3_114) ; port MGTRX114PN.MGTRX114_3_P
MGTRX115_0_N: IC33.N4(MGTRXN0_115) ; port MGTRX115PN.MGTRX115_0_N
MGTRX115_0_P: IC33.N3(MGTRXP0_115) ; port MGTRX115PN.MGTRX115_0_P
MGTRX115_1_N: IC33.L4(MGTRXN1_115) ; port MGTRX115PN.MGTRX115_1_N
MGTRX115_1_P: IC33.L3(MGTRXP1_115) ; port MGTRX115PN.MGTRX115_1_P
MGTRX115_2_N: IC33.K6(MGTRXN2_115) ; port MGTRX115PN.MGTRX115_2_N
MGTRX115_2_P: IC33.K5(MGTRXP2_115) ; port MGTRX115PN.MGTRX115_2_P
MGTRX115_3_N: IC33.J4(MGTRXN3_115) ; port MGTRX115PN.MGTRX115_3_N
MGTRX115_3_P: IC33.J3(MGTRXP3_115) ; port MGTRX115PN.MGTRX115_3_P
MGTRX116_0_N: IC33.G4(MGTRXN0_116) ; port MGTRX116PN.MGTRX116_0_N
MGTRX116_0_P: IC33.G3(MGTRXP0_116) ; port MGTRX116PN.MGTRX116_0_P
MGTRX116_1_N: IC33.E4(MGTRXN1_116) ; port MGTRX116PN.MGTRX116_1_N
MGTRX116_1_P: IC33.E3(MGTRXP1_116) ; port MGTRX116PN.MGTRX116_1_P
MGTRX116_2_N: IC33.D6(MGTRXN2_116) ; port MGTRX116PN.MGTRX116_2_N
MGTRX116_2_P: IC33.D5(MGTRXP2_116) ; port MGTRX116PN.MGTRX116_2_P
MGTRX116_3_N: IC33.B6(MGTRXN3_116) ; port MGTRX116PN.MGTRX116_3_N
MGTRX116_3_P: IC33.B5(MGTRXP3_116) ; port MGTRX116PN.MGTRX116_3_P
MGTTX112_0_N: IC33.AP2(MGTTXN0_112) ; port MGTTX112PN.MGTTX112_0_N
MGTTX112_0_P: IC33.AP1(MGTTXP0_112) ; port MGTTX112PN.MGTTX112_0_P
MGTTX112_1_N: IC33.AN4(MGTTXN1_112) ; port MGTTX112PN.MGTTX112_1_N
MGTTX112_1_P: IC33.AN3(MGTTXP1_112) ; port MGTTX112PN.MGTTX112_1_P
MGTTX112_2_N: IC33.AM2(MGTTXN2_112) ; port MGTTX112PN.MGTTX112_2_N
MGTTX112_2_P: IC33.AM1(MGTTXP2_112) ; port MGTTX112PN.MGTTX112_2_P
MGTTX112_3_N: IC33.AK2(MGTTXN3_112) ; port MGTTX112PN.MGTTX112_3_N
MGTTX112_3_P: IC33.AK1(MGTTXP3_112) ; port MGTTX112PN.MGTTX112_3_P
MGTTX113_0_N: IC33.AH2(MGTTXN0_113) ; port MGTTX113PN.MGTTX113_0_N
MGTTX113_0_P: IC33.AH1(MGTTXP0_113) ; port MGTTX113PN.MGTTX113_0_P
MGTTX113_1_N: IC33.AF2(MGTTXN1_113) ; port MGTTX113PN.MGTTX113_1_N
MGTTX113_1_P: IC33.AF1(MGTTXP1_113) ; port MGTTX113PN.MGTTX113_1_P
MGTTX113_2_N: IC33.AD2(MGTTXN2_113) ; port MGTTX113PN.MGTTX113_2_N
MGTTX113_2_P: IC33.AD1(MGTTXP2_113) ; port MGTTX113PN.MGTTX113_2_P
MGTTX113_3_N: IC33.AB2(MGTTXN3_113) ; port MGTTX113PN.MGTTX113_3_N
MGTTX113_3_P: IC33.AB1(MGTTXP3_113) ; port MGTTX113PN.MGTTX113_3_P
MGTTX114_0_N: IC33.Y2(MGTTXN0_114) ; port MGTTX114PN.MGTTX114_0_N
MGTTX114_0_P: IC33.Y1(MGTTXP0_114) ; port MGTTX114PN.MGTTX114_0_P
MGTTX114_1_N: IC33.V2(MGTTXN1_114) ; port MGTTX114PN.MGTTX114_1_N
MGTTX114_1_P: IC33.V1(MGTTXP1_114) ; port MGTTX114PN.MGTTX114_1_P
MGTTX114_2_N: IC33.T2(MGTTXN2_114) ; port MGTTX114PN.MGTTX114_2_N
MGTTX114_2_P: IC33.T1(MGTTXP2_114) ; port MGTTX114PN.MGTTX114_2_P
MGTTX114_3_N: IC33.P2(MGTTXN3_114) ; port MGTTX114PN.MGTTX114_3_N
MGTTX114_3_P: IC33.P1(MGTTXP3_114) ; port MGTTX114PN.MGTTX114_3_P
MGTTX115_0_N: IC33.M2(MGTTXN0_115) ; port MGTTX115PN.MGTTX115_0_N
MGTTX115_0_P: IC33.M1(MGTTXP0_115) ; port MGTTX115PN.MGTTX115_0_P
MGTTX115_1_N: IC33.K2(MGTTXN1_115) ; port MGTTX115PN.MGTTX115_1_N
MGTTX115_1_P: IC33.K1(MGTTXP1_115) ; port MGTTX115PN.MGTTX115_1_P
MGTTX115_2_N: IC33.H2(MGTTXN2_115) ; port MGTTX115PN.MGTTX115_2_N
MGTTX115_2_P: IC33.H1(MGTTXP2_115) ; port MGTTX115PN.MGTTX115_2_P
MGTTX115_3_N: IC33.F2(MGTTXN3_115) ; port MGTTX115PN.MGTTX115_3_N
MGTTX115_3_P: IC33.F1(MGTTXP3_115) ; port MGTTX115PN.MGTTX115_3_P
MGTTX116_0_N: IC33.D2(MGTTXN0_116) ; port MGTTX116PN.MGTTX116_0_N
MGTTX116_0_P: IC33.D1(MGTTXP0_116) ; port MGTTX116PN.MGTTX116_0_P
MGTTX116_1_N: IC33.C4(MGTTXN1_116) ; port MGTTX116PN.MGTTX116_1_N
MGTTX116_1_P: IC33.C3(MGTTXP1_116) ; port MGTTX116PN.MGTTX116_1_P
MGTTX116_2_N: IC33.B2(MGTTXN2_116) ; port MGTTX116PN.MGTTX116_2_N
MGTTX116_2_P: IC33.B1(MGTTXP2_116) ; port MGTTX116PN.MGTTX116_2_P
MGTTX116_3_N: IC33.A4(MGTTXN3_116) ; port MGTTX116PN.MGTTX116_3_N
MGTTX116_3_P: IC33.A3(MGTTXP3_116) ; port MGTTX116PN.MGTTX116_3_P
NetIC33_AN7: IC33.AN7(MGTRREF_115) R59.2

Not connected (* = marked no-connect by the designer): IC33 AB5(MGTREFCLK1N_113)* AB6(MGTREFCLK1P_113)* AH5(MGTREFCLK1N_112)* AH6(MGTREFCLK1P_112)* F5(MGTREFCLK1N_116)* F6(MGTREFCLK1P_116)* M5(MGTREFCLK1N_115)* M6(MGTREFCLK1P_115)* T5(MGTREFCLK1N_114)* T6(MGTREFCLK1P_114)*

### Layout directives
differential pair: MGTREFCLK112_N, MGTREFCLK112_P, MGTREFCLK113_N, MGTREFCLK113_P, MGTREFCLK114_N, MGTREFCLK114_P, MGTREFCLK115_N, MGTREFCLK115_P, MGTREFCLK116_N, MGTREFCLK116_P, MGTRX112_0_N, MGTRX112_0_P, MGTRX112_1_N, MGTRX112_1_P, MGTRX112_2_N, MGTRX112_2_P, MGTRX112_3_N, MGTRX112_3_P, MGTRX113_0_N, MGTRX113_0_P, MGTRX113_1_N, MGTRX113_1_P, MGTRX113_2_N, MGTRX113_2_P, MGTRX113_3_N, MGTRX113_3_P, MGTRX114_0_N, MGTRX114_0_P, MGTRX114_1_N, MGTRX114_1_P, MGTRX114_2_N, MGTRX114_2_P, MGTRX114_3_N, MGTRX114_3_P, MGTRX115_0_N, MGTRX115_0_P, MGTRX115_1_N, MGTRX115_1_P, MGTRX115_2_N, MGTRX115_2_P, MGTRX115_3_N, MGTRX115_3_P, MGTRX116_0_N, MGTRX116_0_P, MGTRX116_1_N, MGTRX116_1_P, MGTRX116_2_N, MGTRX116_2_P, MGTRX116_3_N, MGTRX116_3_P, MGTTX112_0_N, MGTTX112_0_P, MGTTX112_1_N, MGTTX112_1_P, MGTTX112_2_N, MGTTX112_2_P, MGTTX112_3_N, MGTTX112_3_P, MGTTX113_0_N, MGTTX113_0_P, MGTTX113_1_N, MGTTX113_1_P, MGTTX113_2_N, MGTTX113_2_P, MGTTX113_3_N, MGTTX113_3_P, MGTTX114_0_N, MGTTX114_0_P, MGTTX114_1_N, MGTTX114_1_P, MGTTX114_2_N, MGTTX114_2_P, MGTTX114_3_N, MGTTX114_3_P, MGTTX115_0_N, MGTTX115_0_P, MGTTX115_1_N, MGTTX115_1_P, MGTTX115_2_N, MGTTX115_2_P, MGTTX115_3_N, MGTTX115_3_P, MGTTX116_0_N, MGTTX116_0_P, MGTTX116_1_N, MGTTX116_1_P, MGTTX116_2_N, MGTTX116_2_P, MGTTX116_3_N, MGTTX116_3_P

### Notes on the sheet
- Power Supply Decoupling Capacitors
  According to Xilinx UG366 (v2.3), page 230, the suggested filtering for the MGTAVCC and MGTAVTT power supplies is:
  - One 0.22uF, size 0402, ceramic capacitor per power supply pin
  - One 4.7uF, size 0402, ceramic capacitor per two Quads
  - One 330uF bulk capacitor for each power supply
- Title:
- Size:
- Revision:
- A3
- Drawn by:
- Date:
- Sheet
- of
- Project:

### Library data of the parts
C91-C96 = CC0603_4.7UF_10V_10%_X5R: as C68 on sheet CPU_100M_Ethernet; Published: 8-Jun-2000; LatestRevisionDate: 17-Jul-2002; LatestRevisionNote: Re-released for DXP Platform.; PackageReference: RAD-0.3; Publisher: Altium Limited; Distributor1: Digikey; Distributor1 PN: 445-5170-1-ND; Case: 0603; Value: 4.7uF
C97 C98 = CP2917_330UF_6.3V_20%_TANT: Polarized Capacitor Tantalum; Manufacturer1: Kemet; Manufacturer1 PN: T520D337M006ATE025; Tolerance: ±20%; Voltage: 6.3V; ESR: 25mOhm; Published: 8-Jun-2000; LatestRevisionDate: 17-Jul-2002; LatestRevisionNote: Re-released for DXP Platform.; PackageReference: RB7.6-15; Publisher: Altium Limited; Case: 2917; Distributor1: Digikey; Distributor1 PN: 399-4053-1-ND; TC: Tantalum; Value: 330uF
C100 = CC0402_100NF_16V_10%_X7R: as C240 on sheet RS232_and_USB_ports; Published: 8-Jun-2000; LatestRevisionDate: 17-Jul-2002; LatestRevisionNote: Re-released for DXP Platform.; PackageReference: RAD-0.3; Publisher: Altium Limited; Distributor1: Digikey; Distributor1 PN: 445-4952-1-ND; Case: 0402; Value: 100nF
C104-C121 C123 C124 C126-C137 = CC0402_220NF_16V_10%_X7R: Capacitor; Manufacturer1: TDK; Manufacturer1 PN: C1005X7R1C224K; TC: X7R; Tolerance: ±10%; Voltage: 16V; Published: 8-Jun-2000; LatestRevisionDate: 17-Jul-2002; LatestRevisionNote: Re-released for DXP Platform.; PackageReference: RAD-0.3; Publisher: Altium Limited; Distributor1: Digikey; Distributor1 PN: 445-5936-1-ND; Case: 0402; Value: 220nF
IC33 = XC6VLX130T-1FF1156C: as IC33 on sheet CPU_EBI1_FPGA_Memory; FirstPublished: 17-Nov-2009; DatasheetVersion: v2.0, Sep-2009; PackageVersion: ver1.0, Jun-2009; PackageReference: FF1156; Publisher: Altium Limited; PackageDescription: 1156-Ball Flip-Chip Fine Pitch Ball Grid Array (FF1156); Code_JEDEC: MS-034-AAR-1; Code_IPC: BGA100P34X34-1156; ComponentLink1Description: Virtex-6 Datasheet; ComponentLink1URL: http://www.xilinx.com/support/documentation/data_sheets/ds150.pdf; ComponentLink2Description: Pinout Specification; ComponentLink2URL: http://www.xilinx.com/support/packagefiles/virtex-6-pkgs.htm; ComponentLink3Description: FF1156 Package Drawing; ComponentLink3URL: http://www.xilinx.com/support/documentation/package_specs/ff1156.pdf; ComponentLink4Description: Virtex-6 Documents; ComponentLink4URL: http://www.xilinx.com/support/documentation/virtex-6.htm; ComponentLink5Description: Xilinx.com Home; ComponentLink5URL: http://www.xilinx.com
R59 = R0402_100R_±1%_0.1W_100PPM: as R193 on sheet RS232_and_USB_ports; Case: 0402; Distributor1: DigiKey; Distributor1 PN: P100LCT-ND; Value: 100R